# EAGLE schematic nicie - 6 (EAGLE 7.7.0)
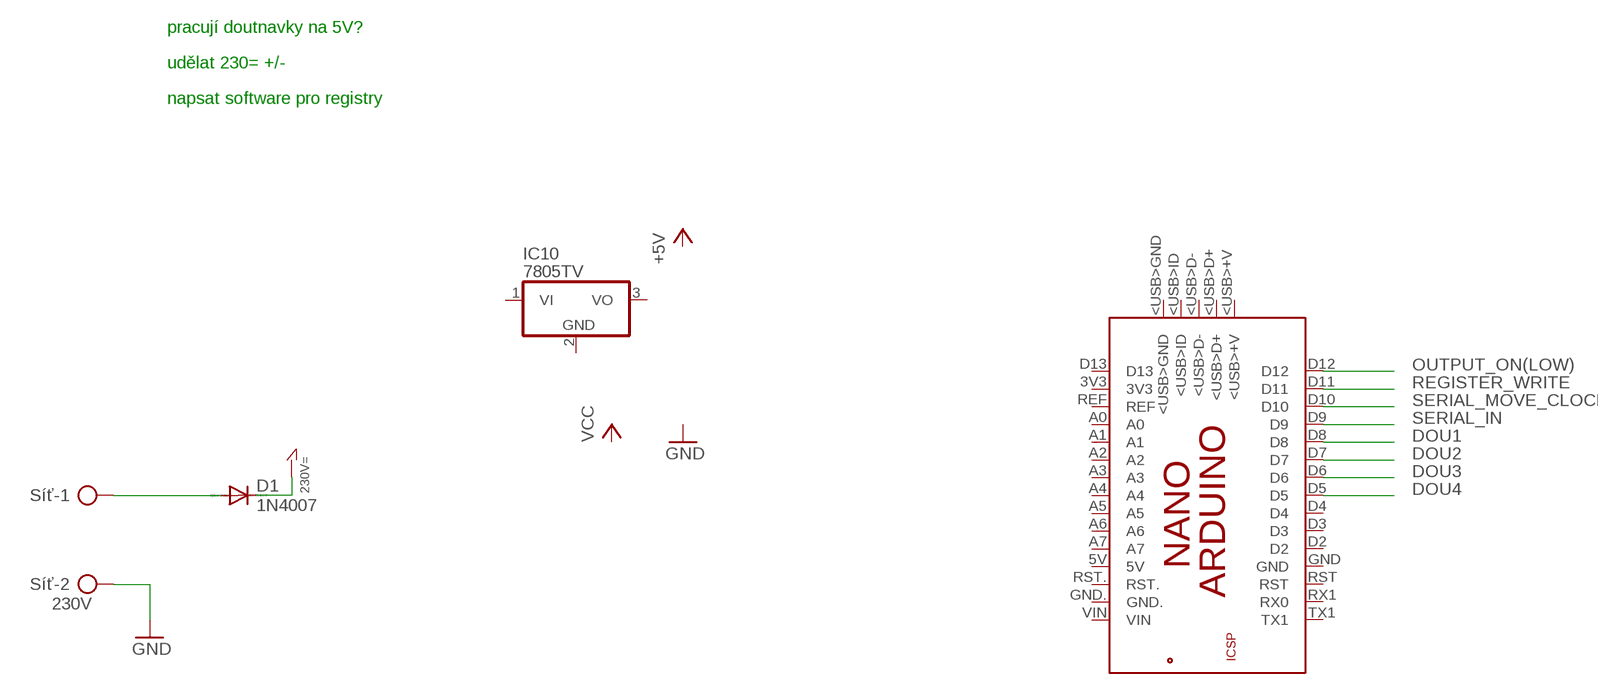
[diagram p0: schematic, sheet 1, part 1 of 2]
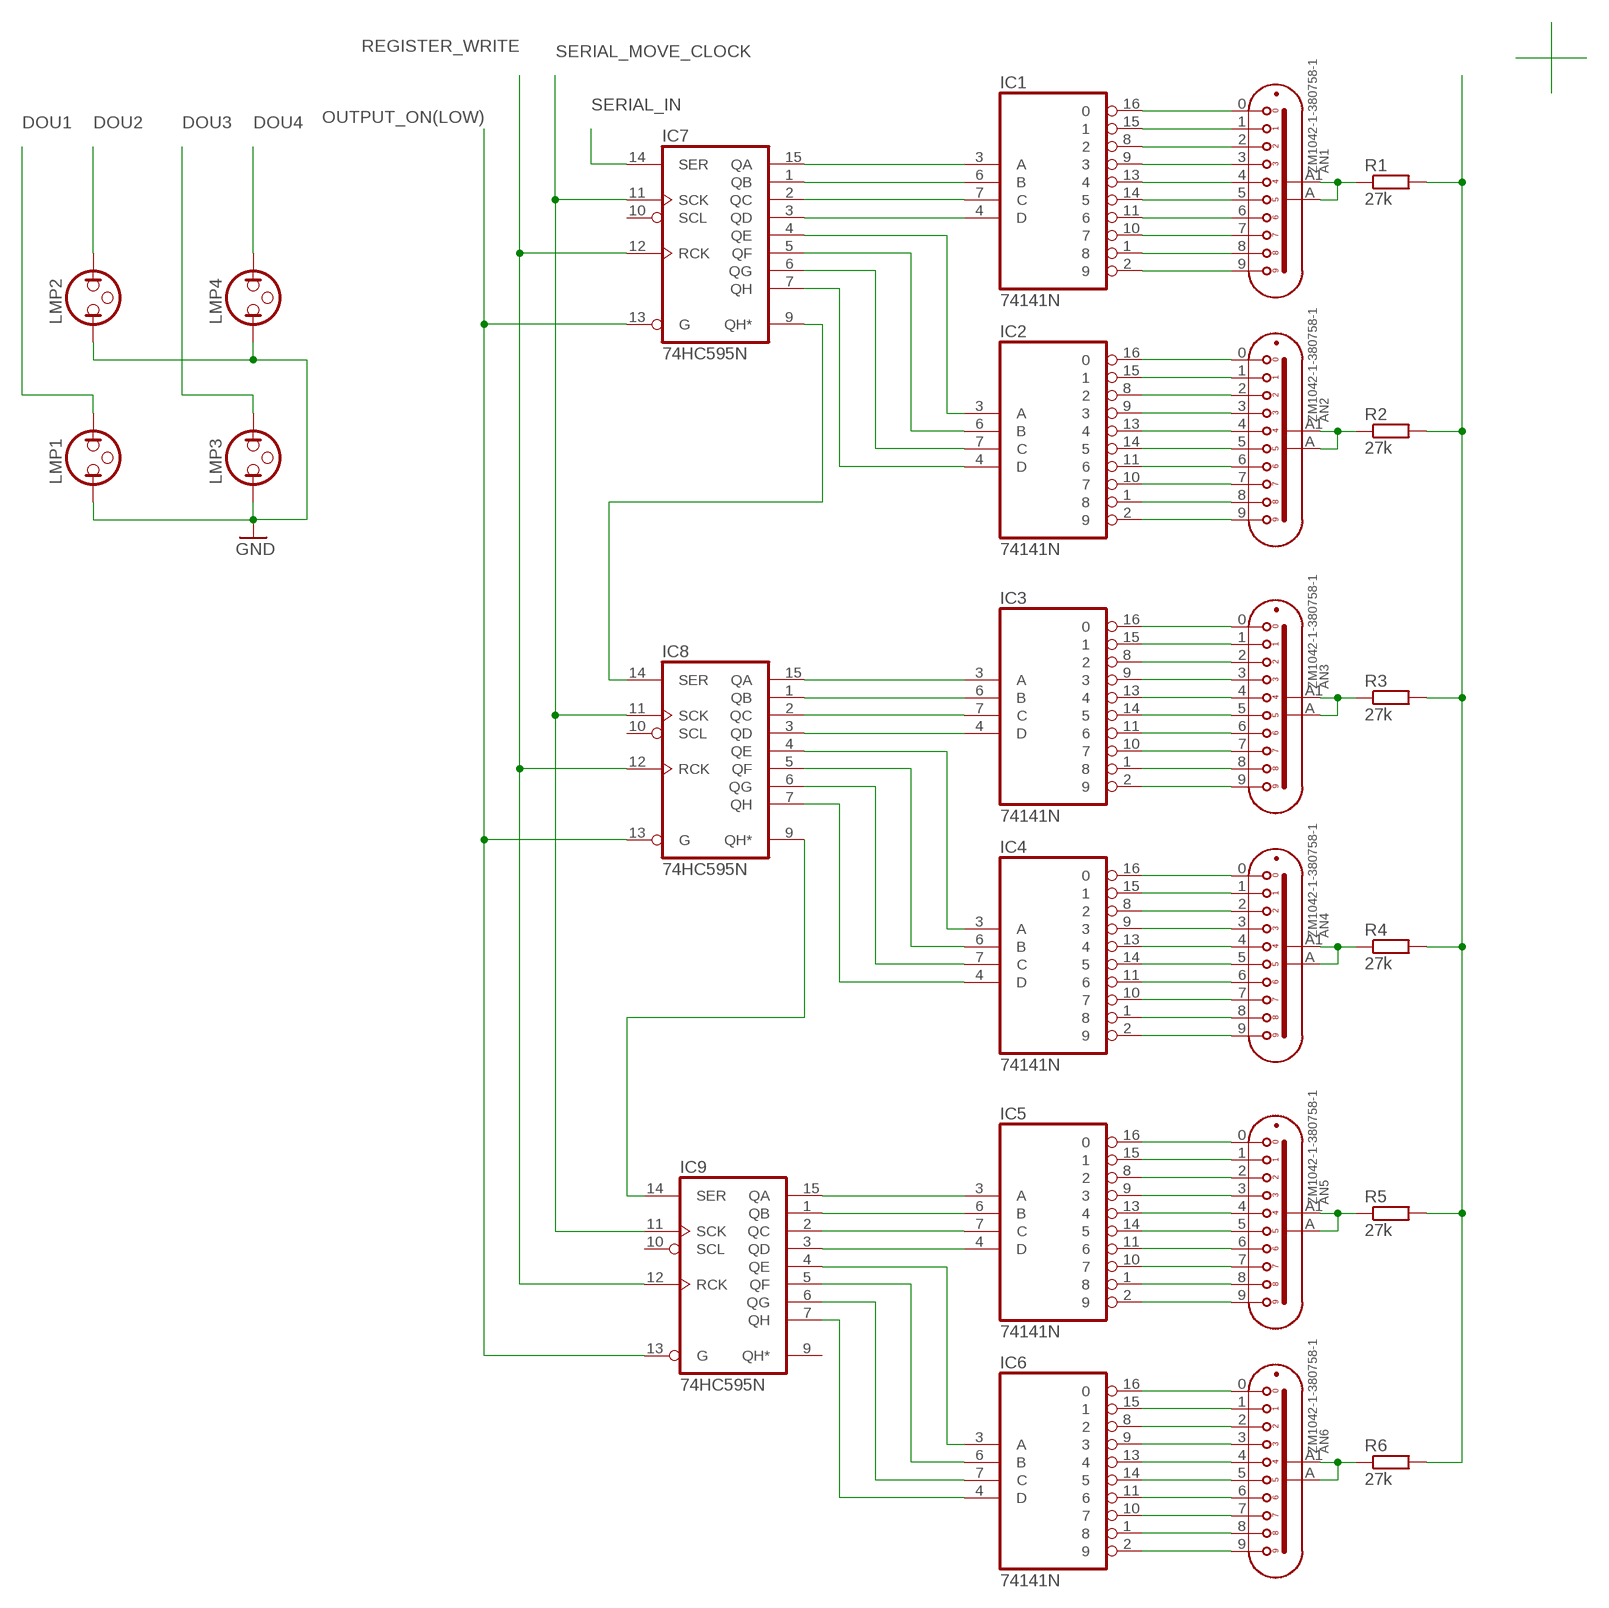
[diagram p1: schematic, sheet 1, part 2 of 2]

## Parts
AN1  ZM1042-1-380758-1  [ZM1042-AMP]
AN2  ZM1042-1-380758-1  [ZM1042-AMP]
AN3  ZM1042-1-380758-1  [ZM1042-AMP]
AN4  ZM1042-1-380758-1  [ZM1042-AMP]
AN5  ZM1042-1-380758-1  [ZM1042-AMP]
AN6  ZM1042-1-380758-1  [ZM1042-AMP]
D1  1N4007  1N4004  [DO41-10]
IC1  74141N  [DIL16]
IC2  74141N  [DIL16]
IC3  74141N  [DIL16]
IC4  74141N  [DIL16]
IC5  74141N  [DIL16]
IC6  74141N  [DIL16]
IC7  74HC595N  [DIL16]
IC8  74HC595N  [DIL16]
IC9  74HC595N  [DIL16]
IC10  7805TV  [TO220V]
LMP1  NEON  [LDH-3R]
LMP2  NEON  [LDH-3R]
LMP3  NEON  [LDH-3R]
LMP4  NEON  [LDH-3R]
PCB1  ARDUINO_NANO  [ARDUINO_NANO]
R1  27k  R-EU_0309/12  [0309/12]
R2  27k  R-EU_0309/12  [0309/12]
R3  27k  R-EU_0309/12  [0309/12]
R4  27k  R-EU_0309/12  [0309/12]
R5  27k  R-EU_0309/12  [0309/12]
R6  27k  R-EU_0309/12  [0309/12]
Síť  230V  AK500/2  [AK500/2]

## Nets
230V=: D1.C
DOU1: LMP1.2 PCB1.D8
DOU2: LMP2.2 PCB1.D7
DOU3: LMP3.2 PCB1.D6
DOU4: LMP4.2 PCB1.D5
GND: LMP1.1 LMP2.1 LMP3.1 LMP4.1 Síť.2
N$1: AN1.0 IC1.16
N$2: AN1.1 IC1.15
N$3: AN1.2 IC1.8
N$4: AN1.3 IC1.9
N$5: AN1.4 IC1.13
N$6: AN1.5 IC1.14
N$7: AN1.6 IC1.11
N$8: AN1.7 IC1.10
N$9: AN1.8 IC1.1
N$10: AN1.9 IC1.2
N$11: AN4.1 IC4.15
N$12: AN4.2 IC4.8
N$13: AN4.4 IC4.13
N$14: AN4.3 IC4.9
N$15: AN4.5 IC4.14
N$16: AN4.6 IC4.11
N$17: AN4.7 IC4.10
N$18: AN4.8 IC4.1
N$19: AN4.9 IC4.2
N$20: AN4.0 IC4.16
N$21: AN3.1 IC3.15
N$22: AN3.2 IC3.8
N$23: AN3.4 IC3.13
N$24: AN3.3 IC3.9
N$25: AN3.5 IC3.14
N$26: AN3.6 IC3.11
N$27: AN3.7 IC3.10
N$28: AN3.8 IC3.1
N$29: AN3.9 IC3.2
N$30: AN3.0 IC3.16
N$31: AN2.1 IC2.15
N$32: AN2.2 IC2.8
N$33: AN2.4 IC2.13
N$34: AN2.3 IC2.9
N$35: AN2.5 IC2.14
N$36: AN2.6 IC2.11
N$37: AN2.7 IC2.10
N$38: AN2.8 IC2.1
N$39: AN2.9 IC2.2
N$40: AN2.0 IC2.16
N$41: AN6.1 IC6.15
N$42: AN6.2 IC6.8
N$43: AN6.4 IC6.13
N$44: AN6.3 IC6.9
N$45: AN6.5 IC6.14
N$46: AN6.6 IC6.11
N$47: AN6.7 IC6.10
N$48: AN6.8 IC6.1
N$49: AN6.9 IC6.2
N$50: AN6.0 IC6.16
N$51: AN5.1 IC5.15
N$52: AN5.2 IC5.8
N$53: AN5.4 IC5.13
N$54: AN5.3 IC5.9
N$55: AN5.5 IC5.14
N$56: AN5.6 IC5.11
N$57: AN5.7 IC5.10
N$58: AN5.8 IC5.1
N$59: AN5.9 IC5.2
N$60: AN5.0 IC5.16
N$61: IC1.3(A) IC7.15(QA)
N$62: IC1.6(B) IC7.1(QB)
N$63: IC1.7(C) IC7.2(QC)
N$64: IC1.4(D) IC7.3(QD)
N$65: IC2.3(A) IC7.4(QE)
N$66: IC2.6(B) IC7.5(QF)
N$67: IC2.7(C) IC7.6(QG)
N$68: IC2.4(D) IC7.7(QH)
N$69: IC3.3(A) IC8.15(QA)
N$70: IC3.6(B) IC8.1(QB)
N$71: IC3.7(C) IC8.2(QC)
N$72: IC3.4(D) IC8.3(QD)
N$73: IC4.3(A) IC8.4(QE)
N$74: IC4.6(B) IC8.5(QF)
N$75: IC4.7(C) IC8.6(QG)
N$76: IC4.4(D) IC8.7(QH)
N$77: IC5.3(A) IC9.15(QA)
N$78: IC5.6(B) IC9.1(QB)
N$79: IC5.7(C) IC9.2(QC)
N$80: IC5.4(D) IC9.3(QD)
N$81: IC6.3(A) IC9.4(QE)
N$82: IC6.6(B) IC9.5(QF)
N$83: IC6.7(C) IC9.6(QG)
N$84: IC6.4(D) IC9.7(QH)
N$85: IC7.9(QH*) IC8.14(SER)
N$86: IC8.9(QH*) IC9.14(SER)
N$88: D1.A Síť.1
N$89: AN1.A1(A2) AN1.A(A1) R1.1
N$90: AN2.A1(A2) AN2.A(A1) R2.1
N$91: AN3.A1(A2) AN3.A(A1) R3.1
N$92: AN4.A1(A2) AN4.A(A1) R4.1
N$93: AN5.A1(A2) AN5.A(A1) R5.1
N$94: AN6.A1(A2) AN6.A(A1) R6.1
N$95: R1.2 R2.2 R3.2 R4.2 R5.2 R6.2
OUTPUT_ON(LOW): IC7.13(G) IC8.13(G) IC9.13(G) PCB1.D12
REGISTER_WRITE: IC7.12(RCK) IC8.12(RCK) IC9.12(RCK) PCB1.D11
SERIAL_IN: IC7.14(SER) PCB1.D9
SERIAL_MOVE_CLOCK: IC7.11(SCK) IC8.11(SCK) IC9.11(SCK) PCB1.D10
Unconnected: IC7.10(SCL) IC8.10(SCL) IC9.9(QH*) IC9.10(SCL) IC10.1(VI) IC10.2(GND) IC10.3(VO) PCB1.3V3 PCB1.5V PCB1.5V. PCB1.<USB>+V PCB1.<USB>D+ PCB1.<USB>D- PCB1.<USB>GND PCB1.<USB>ID PCB1.A0 PCB1.A1 PCB1.A2 PCB1.A3 PCB1.A4 PCB1.A5 PCB1.A6 PCB1.A7 PCB1.D2 PCB1.D3 PCB1.D4 PCB1.D13 PCB1.GND PCB1.GND. PCB1.GND_ PCB1.MISO PCB1.MOSI PCB1.REF PCB1.RESET.. PCB1.RST PCB1.RST. PCB1.RX1(RX0) PCB1.SCK PCB1.TX1 PCB1.VIN

## Notes on the sheet
- pracují doutnavky na 5V?
- udělat 230= +/-
- napsat software pro registry

## Power pins joined to a net without a drawn wire
230V=: IC1.5(230V=) IC2.5(230V=) IC3.5(230V=) IC4.5(230V=) IC5.5(230V=) IC6.5(230V=)
GND: IC1.12(GND) IC2.12(GND) IC3.12(GND) IC4.12(GND) IC5.12(GND) IC6.12(GND) IC7.8(GND) IC8.8(GND) IC9.8(GND)
VCC: IC7.16(VCC) IC8.16(VCC) IC9.16(VCC)

## Library data of the parts
AN1-AN6 = nixie_tube:ZM1042: Indicator Tube (numeral height 30mm, no filter, side view, long-life typ)
D1 = diode:1N4004: DIODE general purpose rectifier, 1 A
IC1-IC6 = 74xx-eu:74*141: BCD to decimal DECODER/DRIVER
IC7-IC9 = 74xx-eu:74*595: 8-bit SHIFT REGISTER, output latch
IC10 = linear:78*: Positive VOLTAGE REGULATOR Source: http://cache.national.com/ds/LM/LM78L05.pdf http://www.fairchildsemi.com/ds/LM/LM7805.pdf
LMP1-LMP4 = special:NEON: Neon LAMP
PCB1 = E14_Arduino_revC:ARDUINO_NANO: Device for representing an Arduino Nano board with a footprint in an EAGLE design. Created by Dave Young for Element14. More EAGLE documentation at: http://www.element14.com/community/community/knode/cadsoft_eagle
R1-R6 = resistor:R-EU_: RESISTOR, European symbol
Síť = con-ptr500:AK500/2: CONNECTOR; OC_FARNELL: unknown; OC_NEWARK: unknown